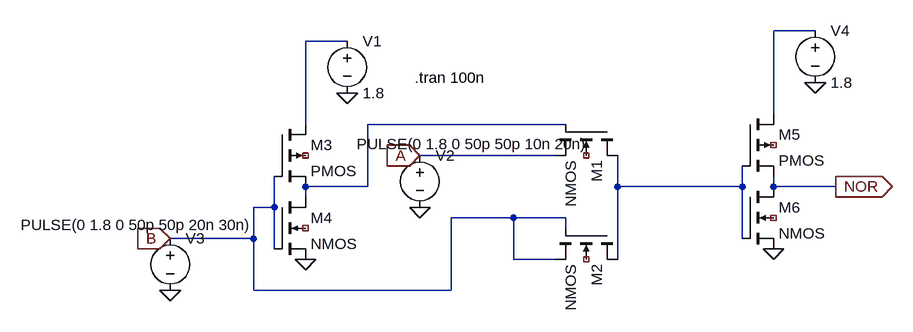
[diagram p0: schematic NOR.asc]
NOR.asc, the LTspice schematic file:
Version 4.1
SHEET 1 984 680
WIRE 864 -96 800 -96
WIRE 144 -80 80 -80
WIRE 800 32 800 -96
WIRE 80 48 80 -80
WIRE 480 48 176 48
WIRE 464 96 256 96
WIRE 176 144 176 48
WIRE 176 144 80 144
WIRE 560 144 560 96
WIRE 752 144 752 112
WIRE 752 144 560 144
WIRE 800 144 800 128
WIRE 896 144 800 144
WIRE 80 160 80 144
WIRE 32 176 32 128
WIRE 32 176 0 176
WIRE 400 192 304 192
WIRE 480 192 400 192
WIRE 480 208 480 192
WIRE 0 224 0 176
WIRE 0 224 -128 224
WIRE 752 224 752 144
WIRE 32 240 32 176
WIRE 400 256 400 192
WIRE 464 256 400 256
WIRE 560 256 560 144
WIRE 0 304 0 224
WIRE 304 304 304 192
WIRE 304 304 0 304
FLAG 144 0 0
FLAG 256 176 0
FLAG -128 304 0
FLAG 896 144 NOR
IOPIN 896 144 Out
FLAG 256 96 A
IOPIN 256 96 In
FLAG -128 224 B
IOPIN -128 224 In
FLAG 80 256 0
FLAG 864 -16 0
FLAG 800 240 0
SYMBOL nmos4 560 48 R90
SYMATTR InstName M1
SYMBOL nmos4 560 208 R90
SYMATTR InstName M2
SYMBOL pmos4 32 48 R0
SYMATTR InstName M3
SYMBOL nmos4 32 160 R0
SYMATTR InstName M4
SYMBOL voltage 144 -96 R0
WINDOW 123 0 0 Left 0
WINDOW 39 0 0 Left 0
SYMATTR InstName V1
SYMATTR Value 1.8
SYMBOL voltage 256 80 R0
WINDOW 3 -97 -2 Left 2
WINDOW 123 0 0 Left 0
WINDOW 39 0 0 Left 0
SYMATTR Value PULSE(0 1.8 0 50p 50p 10n 20n)
SYMATTR InstName V2
SYMBOL voltage -128 208 R0
WINDOW 3 -230 -5 Left 2
WINDOW 123 0 0 Left 0
WINDOW 39 0 0 Left 0
SYMATTR Value PULSE(0 1.8 0 50p 50p 20n 30n)
SYMATTR InstName V3
SYMBOL pmos4 752 32 R0
SYMATTR InstName M5
SYMBOL nmos4 752 144 R0
SYMATTR InstName M6
SYMBOL voltage 864 -112 R0
WINDOW 123 0 0 Left 0
WINDOW 39 0 0 Left 0
SYMATTR InstName V4
SYMATTR Value 1.8
TEXT 248 -24 Left 2 !.tran 100n

The netlist it stands for:
* NOR.asc
M1 N004 N003 A NC_01 NMOS
M2 N004 B B NC_02 NMOS
M3 N002 B N003 NC_03 PMOS
M4 N003 B 0 NC_04 NMOS
V1 N002 0 1.8
V2 A 0 PULSE(0 1.8 0 50p 50p 10n 20n)
V3 B 0 PULSE(0 1.8 0 50p 50p 20n 30n)
M5 N001 N004 NOR NC_05 PMOS
M6 NOR N004 0 NC_06 NMOS
V4 N001 0 1.8
.model NMOS NMOS
.model PMOS PMOS
.lib standard.mos
.tran 100n
.backanno
.end